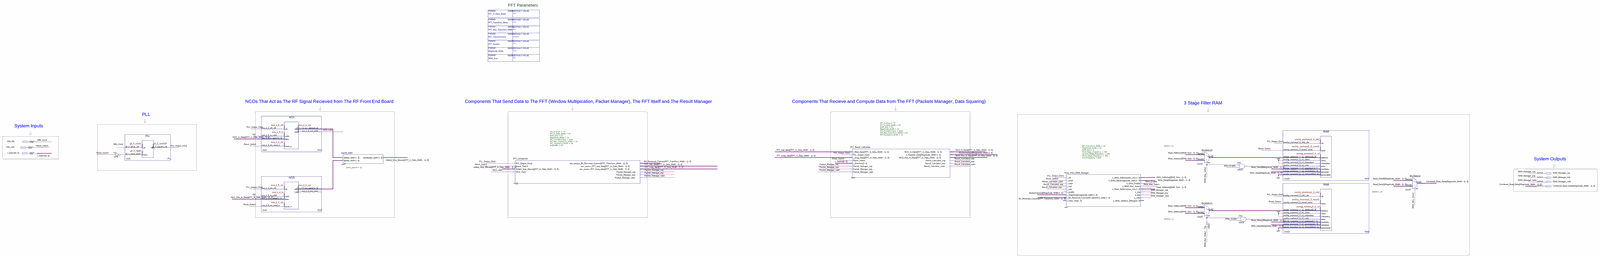
[diagram p0: schematic sheet, whole]
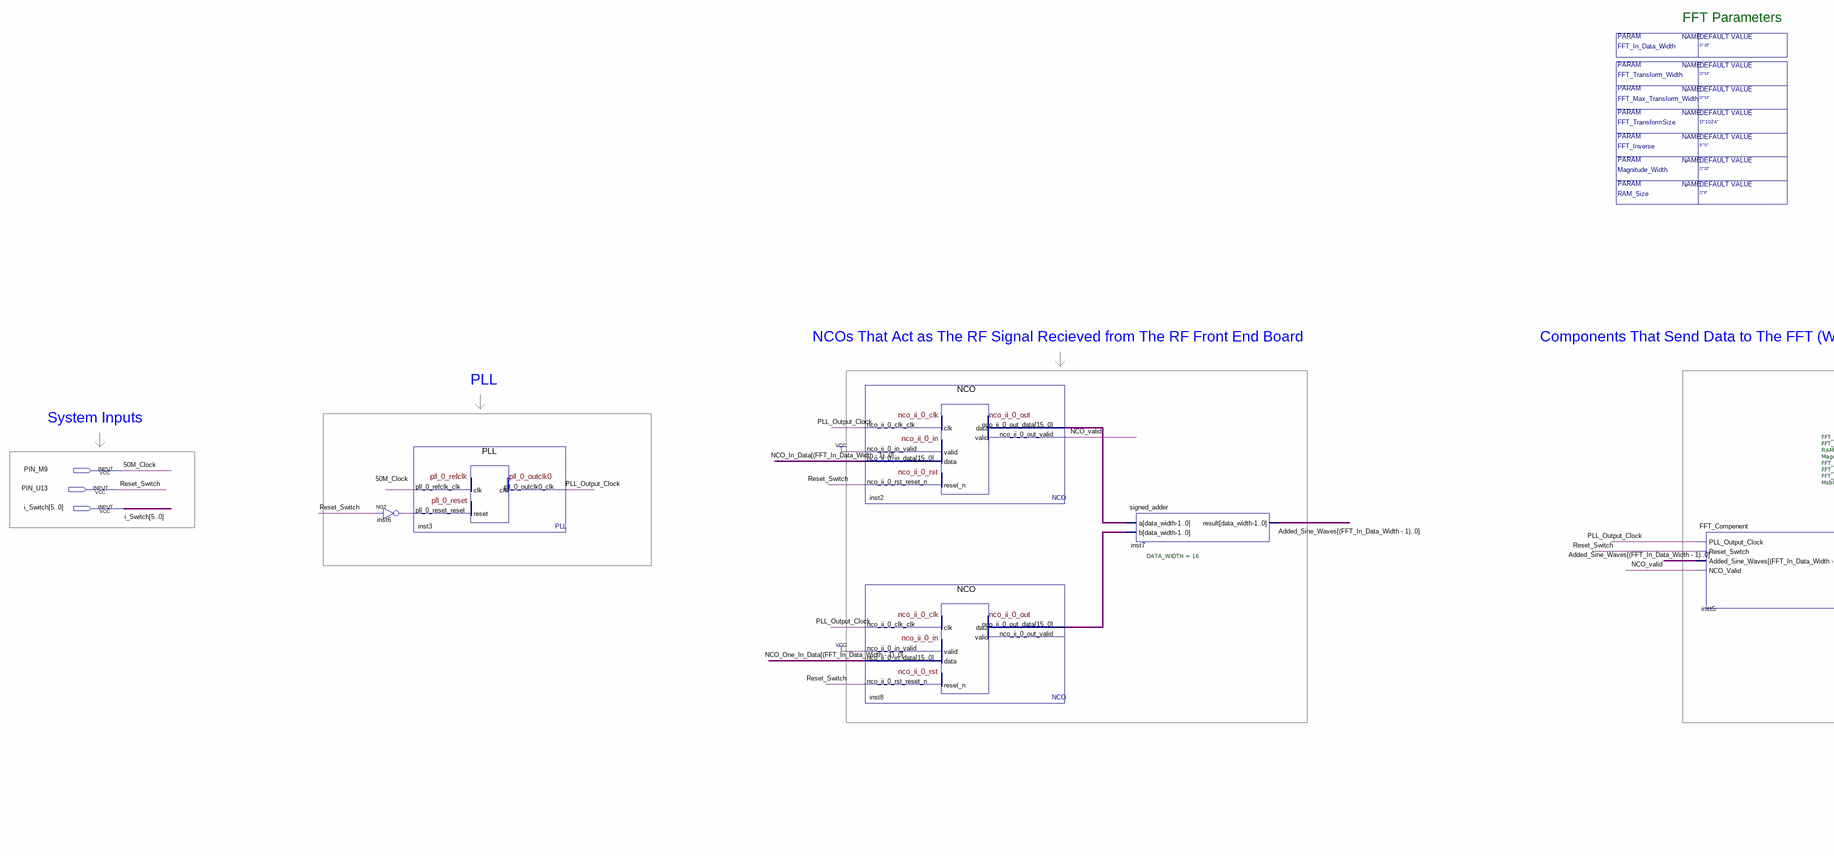
[diagram p1: schematic sheet, left part]
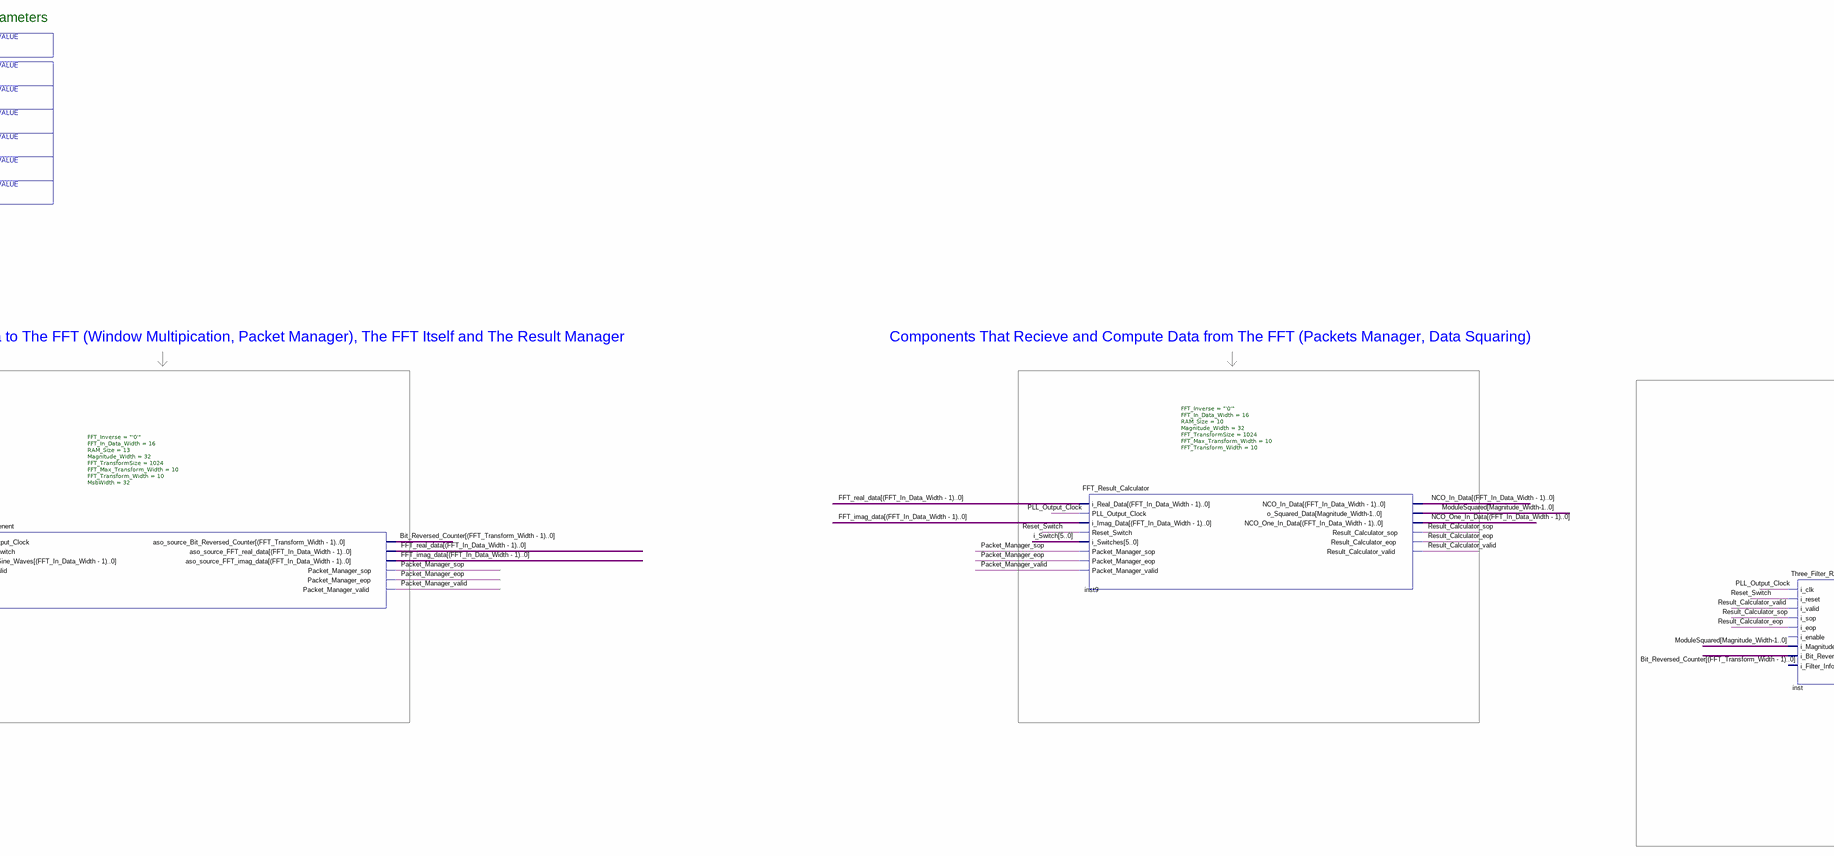
[diagram p2: schematic sheet, centre part]
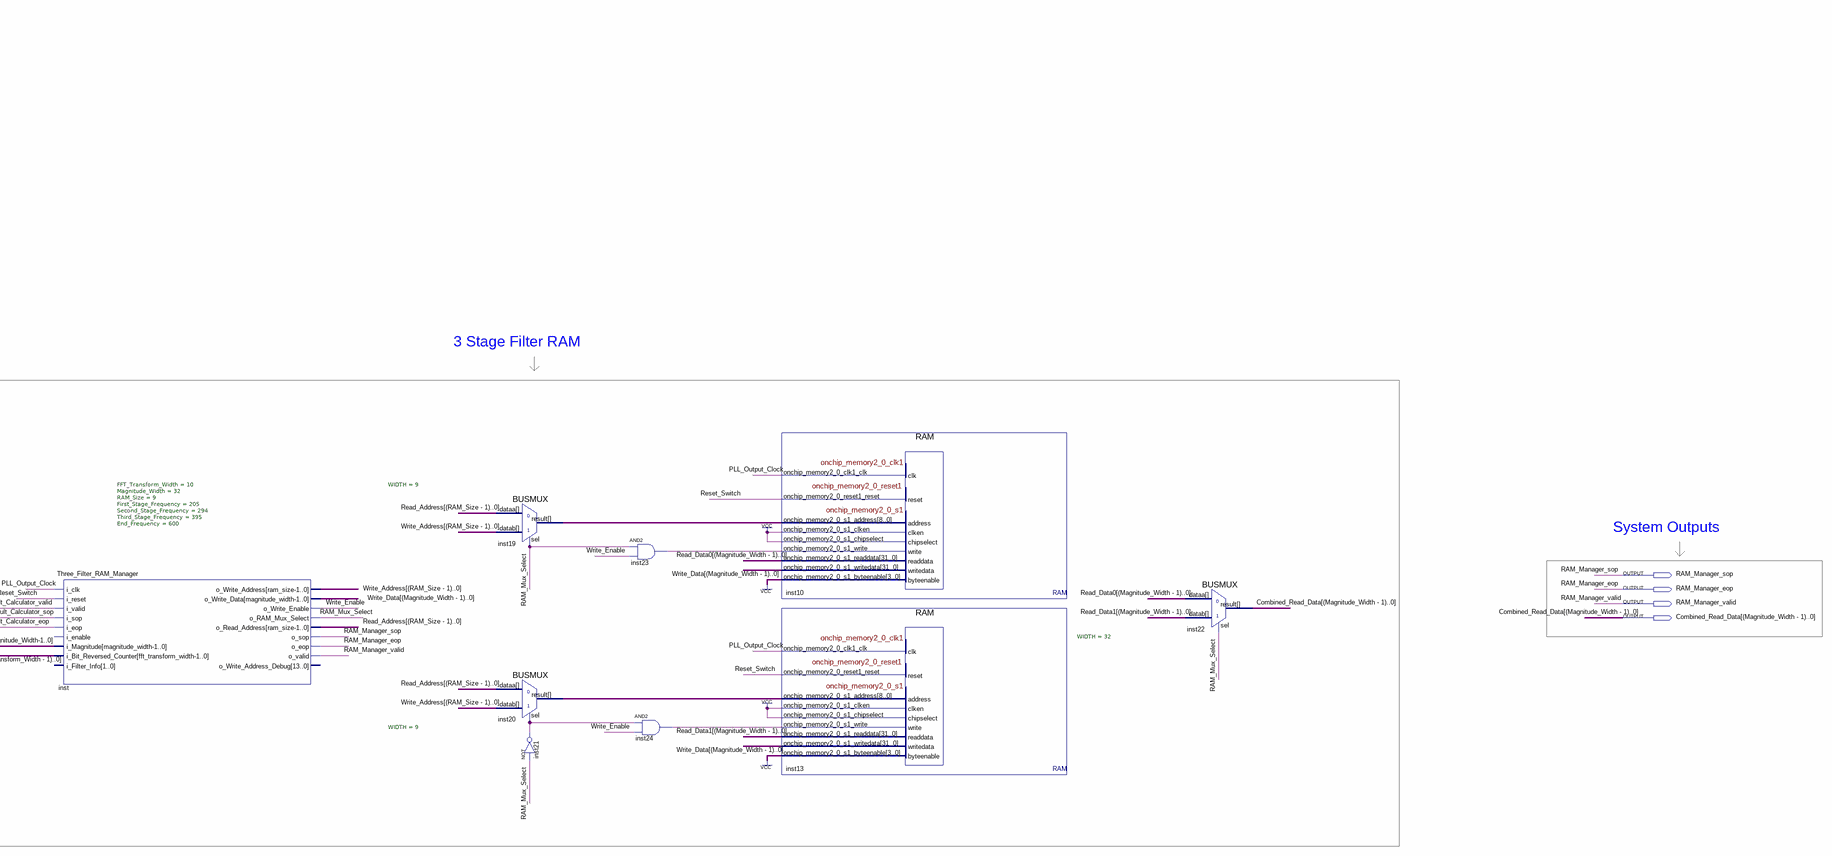
[diagram p3: schematic sheet, right part]
// Quartus schematic Windowed_Block_Diagram.bdf as structural Verilog: 16 symbols, 7 pins
module Windowed_Block_Diagram #(parameter FFT_Inverse = "E\"'0'\"", parameter FFT_In_Data_Width = "D\"16\"", parameter Magnitude_Width = "D\"32\"", parameter FFT_TransformSize = "D\"1024\"", parameter FFT_Max_Transform_Width = "D\"10\"", parameter FFT_Transform_Width = "D\"10\"", parameter RAM_Size = "D\"9\"") (
  input  PIN_M9,
  input  PIN_U13,
  input  [5:0] i_Switch,
  output RAM_Manager_sop,
  output RAM_Manager_eop,
  output RAM_Manager_valid,
  output \Combined_Read_Data[(Magnitude_Width_-_1)..0] 
);

  wire \Added_Sine_Waves[(FFT_In_Data_Width_-_1)..0] , \Bit_Reversed_Counter[(FFT_Transform_Width_-_1)..0] ,
       \FFT_imag_data[(FFT_In_Data_Width_-_1)..0] , \FFT_real_data[(FFT_In_Data_Width_-_1)..0] , inst6_out,
       inst21_out, inst23_out, inst24_out, \ModuleSquared[Magnitude_Width-1..0] ,
       \NCO_In_Data[(FFT_In_Data_Width_-_1)..0] , \NCO_One_In_Data[(FFT_In_Data_Width_-_1)..0] , NCO_valid,
       Packet_Manager_eop, Packet_Manager_sop, Packet_Manager_valid, PLL_Output_Clock, RAM_Mux_Select,
       \Read_Address[(RAM_Size_-_1)..0] , \Read_Data0[(Magnitude_Width_-_1)..0] ,
       \Read_Data1[(Magnitude_Width_-_1)..0] , Result_Calculator_eop, Result_Calculator_sop,
       Result_Calculator_valid, \Write_Address[(RAM_Size_-_1)..0] , \Write_Data[(Magnitude_Width_-_1)..0] ,
       Write_Enable;
  wire [8:0] inst19_result, inst20_result;
  wire [15:0] inst2_nco_ii_0_out_data, inst8_nco_ii_0_out_data;

  not inst6 (inst6_out, PIN_U13);
  PLL inst3 (.pll_0_refclk_clk(PIN_M9), .pll_0_reset_reset(inst6_out), .pll_0_outclk0_clk(PLL_Output_Clock));
  NCO inst2 (
    .nco_ii_0_clk_clk(PLL_Output_Clock), .nco_ii_0_in_valid(1'b1),
    .nco_ii_0_in_data({16{\NCO_In_Data[(FFT_In_Data_Width_-_1)..0] }}), .nco_ii_0_rst_reset_n(PIN_U13),
    .nco_ii_0_out_data(inst2_nco_ii_0_out_data), .nco_ii_0_out_valid(NCO_valid));
  NCO inst8 (
    .nco_ii_0_clk_clk(PLL_Output_Clock), .nco_ii_0_in_valid(1'b1),
    .nco_ii_0_in_data({16{\NCO_One_In_Data[(FFT_In_Data_Width_-_1)..0] }}), .nco_ii_0_rst_reset_n(PIN_U13),
    .nco_ii_0_out_data(inst8_nco_ii_0_out_data));  // open: nco_ii_0_out_valid
  signed_adder #(.DATA_WIDTH(16)) inst7 (
    .a(inst2_nco_ii_0_out_data), .b(inst8_nco_ii_0_out_data),
    .result(\Added_Sine_Waves[(FFT_In_Data_Width_-_1)..0] ));
  FFT_Compenent #(.FFT_Inverse("'0'"), .FFT_In_Data_Width(16), .RAM_Size(13), .Magnitude_Width(32), .FFT_TransformSize(1024), .FFT_Max_Transform_Width(10), .FFT_Transform_Width(10), .MsbWidth(32)) inst5 (
    .PLL_Output_Clock(PLL_Output_Clock), .Reset_Switch(PIN_U13),
    .Added_Sine_Waves({16{\Added_Sine_Waves[(FFT_In_Data_Width_-_1)..0] }}), .NCO_Valid(NCO_valid),
    .aso_source_Bit_Reversed_Counter(\Bit_Reversed_Counter[(FFT_Transform_Width_-_1)..0] ),
    .aso_source_FFT_real_data(\FFT_real_data[(FFT_In_Data_Width_-_1)..0] ),
    .aso_source_FFT_imag_data(\FFT_imag_data[(FFT_In_Data_Width_-_1)..0] ),
    .Packet_Manager_sop(Packet_Manager_sop), .Packet_Manager_eop(Packet_Manager_eop),
    .Packet_Manager_valid(Packet_Manager_valid));
  FFT_Result_Calculator #(.FFT_Inverse("'0'"), .FFT_In_Data_Width(16), .RAM_Size(10), .Magnitude_Width(32), .FFT_TransformSize(1024), .FFT_Max_Transform_Width(10), .FFT_Transform_Width(10)) inst9 (
    .i_Real_Data({16{\FFT_real_data[(FFT_In_Data_Width_-_1)..0] }}), .PLL_Output_Clock(PLL_Output_Clock),
    .i_Imag_Data({16{\FFT_imag_data[(FFT_In_Data_Width_-_1)..0] }}), .Reset_Switch(PIN_U13),
    .i_Switches(i_Switch), .Packet_Manager_sop(Packet_Manager_sop), .Packet_Manager_eop(Packet_Manager_eop),
    .Packet_Manager_valid(Packet_Manager_valid), .NCO_In_Data(\NCO_In_Data[(FFT_In_Data_Width_-_1)..0] ),
    .o_Squared_Data(\ModuleSquared[Magnitude_Width-1..0] ),
    .NCO_One_In_Data(\NCO_One_In_Data[(FFT_In_Data_Width_-_1)..0] ),
    .Result_Calculator_sop(Result_Calculator_sop), .Result_Calculator_eop(Result_Calculator_eop),
    .Result_Calculator_valid(Result_Calculator_valid));
  Three_Filter_RAM_Manager #(.FFT_Transform_Width(10), .Magnitude_Width(32), .RAM_Size(9), .First_Stage_Frequency(205), .Second_Stage_Frequency(294), .Third_Stage_Frequency(395), .End_Frequency(600)) inst (
    .i_clk(PLL_Output_Clock), .i_reset(PIN_U13), .i_valid(Result_Calculator_valid),
    .i_sop(Result_Calculator_sop), .i_eop(Result_Calculator_eop),
    .i_Magnitude({32{\ModuleSquared[Magnitude_Width-1..0] }}),
    .i_Bit_Reversed_Counter({10{\Bit_Reversed_Counter[(FFT_Transform_Width_-_1)..0] }}),
    .o_Write_Address(\Write_Address[(RAM_Size_-_1)..0] ),
    .o_Write_Data(\Write_Data[(Magnitude_Width_-_1)..0] ), .o_Write_Enable(Write_Enable),
    .o_RAM_Mux_Select(RAM_Mux_Select), .o_Read_Address(\Read_Address[(RAM_Size_-_1)..0] ),
    .o_sop(RAM_Manager_sop), .o_eop(RAM_Manager_eop), .o_valid(RAM_Manager_valid));  // open: i_enable, i_Filter_Info, o_Write_Address_Debug
  BUSMUX #(.WIDTH(9)) inst19 (
    .datab({9{\Write_Address[(RAM_Size_-_1)..0] }}), .sel(RAM_Mux_Select),
    .dataa({9{\Read_Address[(RAM_Size_-_1)..0] }}), .result(inst19_result));
  BUSMUX #(.WIDTH(9)) inst20 (
    .datab({9{\Write_Address[(RAM_Size_-_1)..0] }}), .sel(inst21_out),
    .dataa({9{\Read_Address[(RAM_Size_-_1)..0] }}), .result(inst20_result));
  not inst21 (inst21_out, RAM_Mux_Select);
  and inst23 (inst23_out, RAM_Mux_Select, Write_Enable);
  and inst24 (inst24_out, inst21_out, Write_Enable);
  RAM inst10 (
    .onchip_memory2_0_clk1_clk(PLL_Output_Clock), .onchip_memory2_0_reset1_reset(PIN_U13),
    .onchip_memory2_0_s1_address(inst19_result), .onchip_memory2_0_s1_clken(1'b1),
    .onchip_memory2_0_s1_chipselect(1'b1), .onchip_memory2_0_s1_write(inst23_out),
    .onchip_memory2_0_s1_writedata({32{\Write_Data[(Magnitude_Width_-_1)..0] }}),
    .onchip_memory2_0_s1_byteenable(4'b1111),
    .onchip_memory2_0_s1_readdata(\Read_Data0[(Magnitude_Width_-_1)..0] ));
  RAM inst13 (
    .onchip_memory2_0_clk1_clk(PLL_Output_Clock), .onchip_memory2_0_reset1_reset(PIN_U13),
    .onchip_memory2_0_s1_address(inst20_result), .onchip_memory2_0_s1_clken(1'b1),
    .onchip_memory2_0_s1_chipselect(1'b1), .onchip_memory2_0_s1_write(inst24_out),
    .onchip_memory2_0_s1_writedata({32{\Write_Data[(Magnitude_Width_-_1)..0] }}),
    .onchip_memory2_0_s1_byteenable(4'b1111),
    .onchip_memory2_0_s1_readdata(\Read_Data1[(Magnitude_Width_-_1)..0] ));
  BUSMUX #(.WIDTH(32)) inst22 (
    .datab({32{\Read_Data1[(Magnitude_Width_-_1)..0] }}), .sel(RAM_Mux_Select),
    .dataa({32{\Read_Data0[(Magnitude_Width_-_1)..0] }}),
    .result(\Combined_Read_Data[(Magnitude_Width_-_1)..0] ));

  // Other names for the same wires on the sheet: 50M_Clock = PIN_M9; Reset_Switch = PIN_U13

  // Notes on the sheet:
  //   FFT Parameters
  //   NCOs That Act as The RF Signal Recieved from The RF Front End Board       
  //   Components That Send Data to The FFT (Window Multipication, Packet Manager), The FFT Itself and The Result Manager          
  //   Components That Recieve and Compute Data from The FFT (Packets Manager, Data Squaring)          
  //   3 Stage Filter RAM  
  //   PLL
  //   System Inputs   
  //   System Outputs   
endmodule
